# Altium schematic sheet assembly drawing.SchDoc
size A4
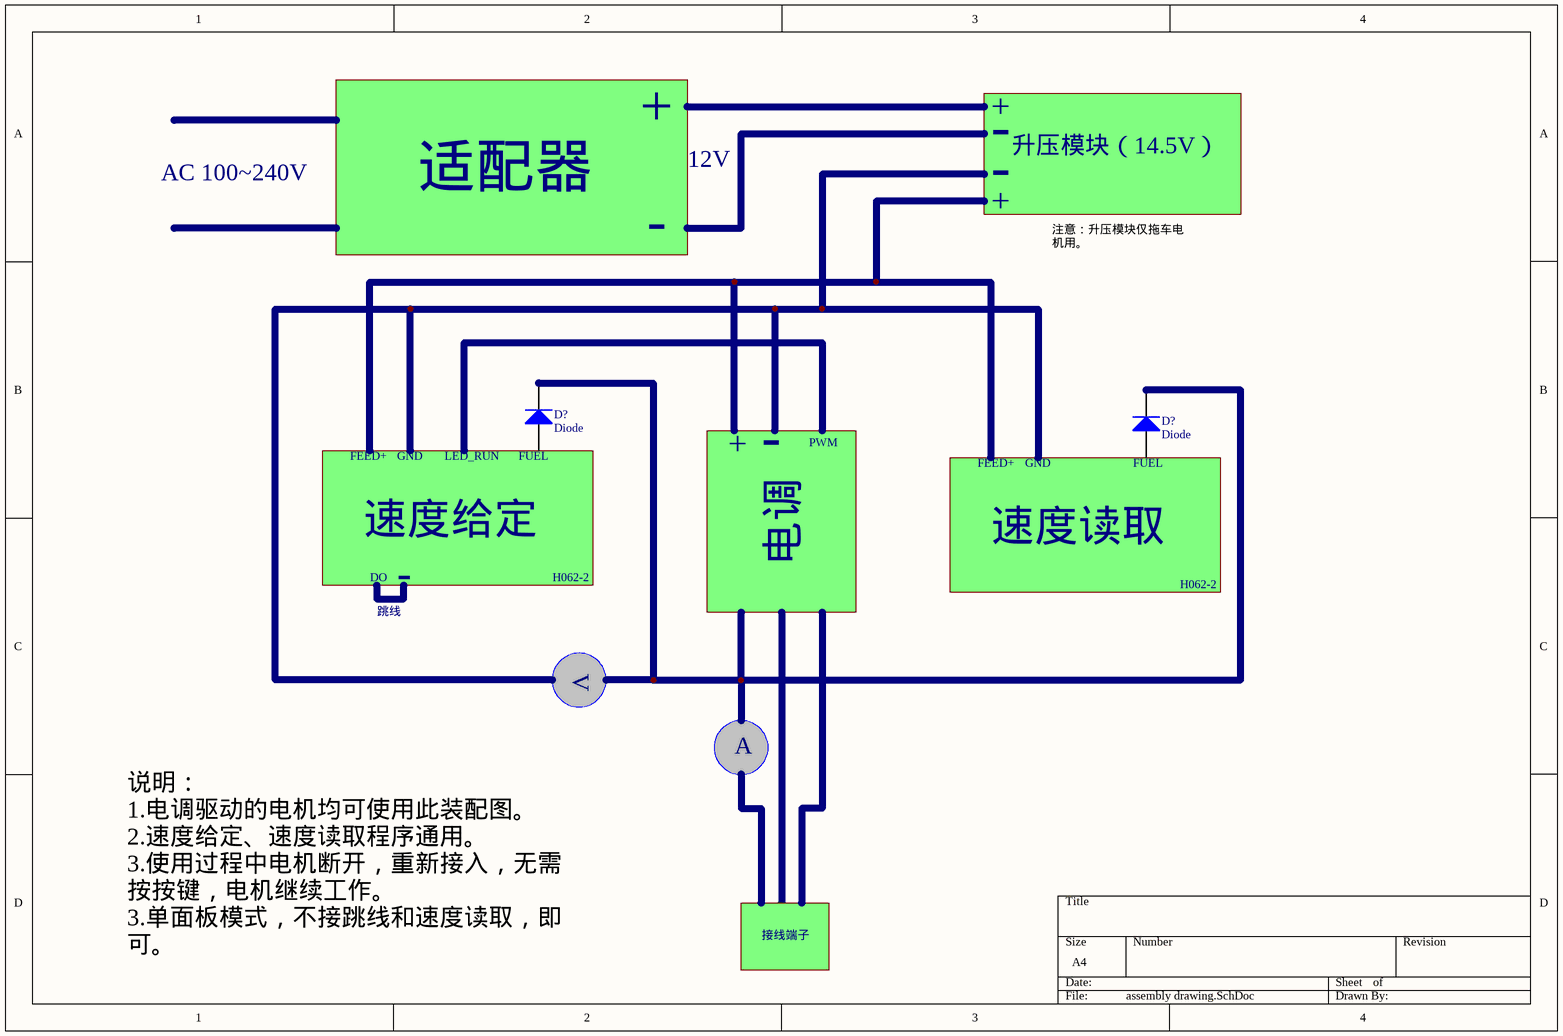
[diagram p0: assembly drawing.SchDoc]

## Parts
(Parts that share a designator on the sheet are numbered #1, #2 ... from top to bottom, then left to right.)
D?#1  Diode  [SMC]
D?#2  Diode  [SMC]

## Sub-sheets
升压模块（14.5V） = ?: no entries
接线端子 = ?: no entries
电调 = ?: no entries
适配器 = ?: no entries
速度给定 = ?: no entries
速度读取 = ?: no entries

## Nets
NetD?#1_2: D?#1.2(K) D?#2.2(K)

Not connected (* = marked no-connect by the designer): D?#1 1(A); D?#2 1(A)

## Notes on the sheet
- +
- 12V
- -
- AC 100~240V
- 注意：升压模块仅拖车电机用。
- PWM
- FEED+
- GND
- LED_RUN
- (near D?#1) FUEL
- (near D?#2) FUEL
- DO
- H062-2
- 跳线
- V
- A
- 说明：
  1.电调驱动的电机均可使用此装配图。
  2.速度给定、速度读取程序通用。
  3.使用过程中电机断开，重新接入，无需按按键，电机继续工作。
  3.单面板模式，不接跳线和速度读取，即可。

## Library data of the parts
D?#1 D?#2 = Diode: Default Diode; Published: 8-Jun-2000; LatestRevisionDate: 17-Jul-2002; LatestRevisionNote: Re-released for DXP Platform.; PackageVersion: Sep-1996; PackageReference: SMC; Publisher: Altium Limited; PackageDescription: DO-214-AB/SMC; 2 C-Bend Leads; Body 7.9 x 5.9 mm, inc. leads (LxW); Code_JEDEC: DO-214-AB